# Altium schematic sheet Buffers.DiagrammaStrutturale.SchDoc
size 420 x 297 mm; Address1: Address1; Address2: Address2; Address3: Address3; Address4: Address4; SheetNumber: 1; Scale: 1:1; Разраб.: Иванов; Обозначение документа: АБВГ.123456.001 Э3; Пров.: Петров; Утв.: Сидоров; Наименование организации: ОАО "Концерн "МПО-Гидроприбор"; Перв. применение: АБВГ.123456.000; Наименование изделия 1: Плата; Наименование изделия 2: Схема электрическая; Наименование изделия 3: принципиальная; Нач. отд.: Нач. отд.; Фамилия нач. отд.: Сидоров
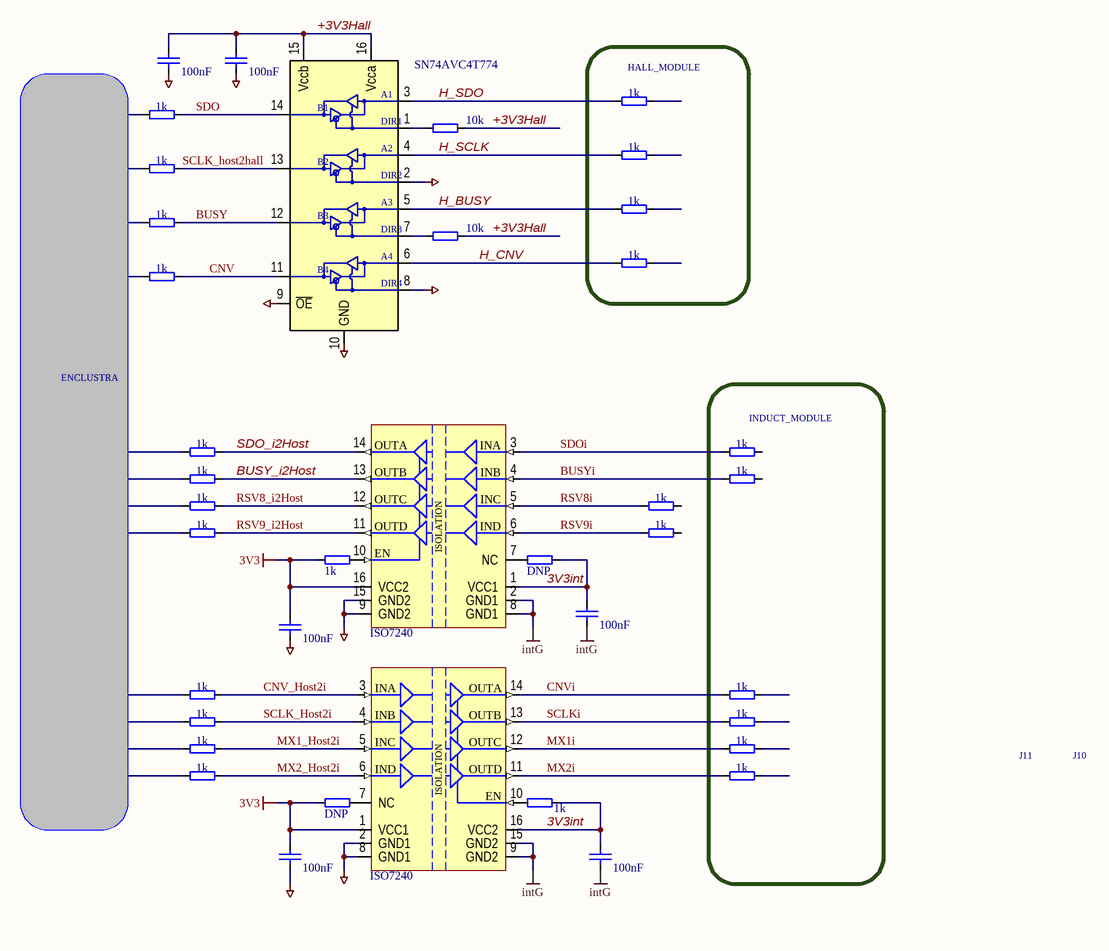
[diagram p0: Buffers.DiagrammaStrutturale.SchDoc]

## Parts
(Parts that share a designator on the sheet are numbered #1, #2 ... from top to bottom, then left to right.)
C?#1  100nF  [SMD0805CAP]
C?#2  100nF  [SMD0805CAP]
C?#3  100nF  [SMD0805CAP]
C?#4  100nF  [SMD0805CAP]
C?#5  100nF  [SMD0805CAP]
C?#6  100nF  [SMD0805CAP]
R?#1  1k  [SMD0805RES]
R?#2  1k  [SMD0805RES]
R?#3  10k  [SMD0805RES]
R?#4  1k  [SMD0805RES]
R?#5  1k  [SMD0805RES]
R?#6  1k  [SMD0805RES]
R?#7  1k  [SMD0805RES]
R?#8  10k  [SMD0805RES]
R?#9  1k  [SMD0805RES]
R?#10  1k  [SMD0805RES]
R?#11  1k  [SMD0805RES]
R?#12  1k  [SMD0805RES]
R?#13  1k  [SMD0805RES]
R?#14  1k  [SMD0805RES]
R?#15  1k  [SMD0805RES]
R?#16  1k  [SMD0805RES]
R?#17  1k  [SMD0805RES]
R?#18  1k  [SMD0805RES]
R?#19  1k  [SMD0805RES]
R?#20  DNP  [SMD0805RES]
R?#21  1k  [SMD0805RES]
R?#22  1k  [SMD0805RES]
R?#23  1k  [SMD0805RES]
R?#24  1k  [SMD0805RES]
R?#25  1k  [SMD0805RES]
R?#26  1k  [SMD0805RES]
R?#27  1k  [SMD0805RES]
R?#28  1k  [SMD0805RES]
R?#29  DNP  [SMD0805RES]
R?#30  1k  [SMD0805RES]
U?#1  SN74AVC4T774  [TSSOP-16]
U?#2  ISO7240  [SOIC127P1030X265-16N]
U?#3  ISO7240  [SOIC127P1030X265-16N]

## Blocks framed on the sheet
HALL_MODULE: R?#1 R?#4 R?#6 R?#9
INDUCT_MODULE: R?#12 R?#14 R?#22 R?#24 R?#26 R?#28

## Nets
3V3: C?#4.2 C?#5.2 R?#19.1 R?#29.1 U?#2.16(VCC2) U?#3.1(VCC1)
GND: C?#1.1 C?#2.1 C?#4.1 C?#5.1 U?#1.2(DIR2) U?#1.8(DIR4) U?#1.9(~{OE}) U?#1.10(GND) U?#2.9(GND2) U?#2.15(GND2) U?#3.2(GND1) U?#3.8(GND1)
intG: C?#3.1 C?#6.1 U?#2.2(GND1) U?#2.8(GND1) U?#3.9(GND2) U?#3.15(GND2)
3V3int: C?#3.2 C?#6.2 R?#20.2 R?#30.2 U?#2.1(VCC1) U?#3.16(VCC2)
+3V3Hall: C?#1.2 C?#2.2 R?#3.1 R?#8.1 U?#1.15(Vccb) U?#1.16(Vcca)
BUSY: R?#7.1 U?#1.12(B3)
BUSY_i2Host: R?#13.1 U?#2.13(OUTB)
BUSYi: R?#14.2 U?#2.4(INB)
CNV: R?#10.1 U?#1.11(B4)
CNV_Host2i: R?#21.1 U?#3.3(INA)
CNVi: R?#22.2 U?#3.14(OUTA)
H_BUSY: R?#6.2 U?#1.5(A3)
H_CNV: R?#9.2 U?#1.6(A4)
H_SCLK: R?#4.2 U?#1.4(A2)
H_SDO: R?#1.2 U?#1.3(A1)
MX1_Host2i: R?#25.1 U?#3.5(INC)
MX1i: R?#26.2 U?#3.12(OUTC)
MX2_Host2i: R?#27.1 U?#3.6(IND)
MX2i: R?#28.2 U?#3.11(OUTD)
RSV8_i2Host: R?#15.1 U?#2.12(OUTC)
RSV8i: R?#16.2 U?#2.5(INC)
RSV9_i2Host: R?#17.1 U?#2.11(OUTD)
RSV9i: R?#18.2 U?#2.6(IND)
SCLK_host2hall: R?#5.1 U?#1.13(B2)
SCLK_Host2i: R?#23.1 U?#3.4(INB)
SCLKi: R?#24.2 U?#3.13(OUTB)
SDO: R?#2.1 U?#1.14(B1)
SDO_i2Host: R?#11.1 U?#2.14(OUTA)
SDOi: R?#12.2 U?#2.3(INA)
NetR?#3_2: R?#3.2 U?#1.1(DIR1)
NetR?#8_2: R?#8.2 U?#1.7(DIR3)
NetR?#19_2: R?#19.2 U?#2.10(EN)
NetR?#20_1: R?#20.1 U?#2.7(NC)
NetR?#29_2: R?#29.2 U?#3.7(NC)
NetR?#30_1: R?#30.1 U?#3.10(EN)

Not connected (* = marked no-connect by the designer): R?#1 1; R?#2 2; R?#4 1; R?#5 2; R?#6 1; R?#7 2; R?#9 1; R?#10 2; R?#11 2; R?#12 1; R?#13 2; R?#14 1; R?#15 2; R?#16 1; R?#17 2; R?#18 1; R?#21 2; R?#22 1; R?#23 2; R?#24 1; R?#25 2; R?#26 1; R?#27 2; R?#28 1

## Notes on the sheet
- ENCLUSTRA
- J11
- J10
- Подп. и дата
- Инв. № дубл.
- Взам. инв. №
- Инв. № подл.
- Изм.
- Лист
- № докум.
- Подп.
- Дата
- Копировал
- Формат А3
- (in symbol ISO7240M) ISOLATION

## Library data of the parts
C?#1-C?#6 = C0805: Чип конденсатор 0805; Voltage: 25V; Vendor: Vishay; DielectricType: X5R; SMD Solders: 2; Solder Option: RM; Tolerance: 20%; Pkg: SMD0805; Device: Cap0805; Value: 100nF; Price: 2
R?#1-R?#18 R?#20-R?#29 = R0805: Чип резистор 0805; Vendor: Vishay; SMD Solders: 2; Solder Option: i; TC: 100ppm/C; Tolerance: 1%; Pkg: SMD0805; Pwr: 125mW; Device: Res0805; Price: 2
  R?#1 R?#2 R?#4-R?#7 R?#9-R?#18 R?#21-R?#28: Value: 1k
  R?#3 R?#8: Value: 10k
  R?#20 R?#29: Value: DNP
R?#19 R?#30 = R0805: Чип резистор 0805; Vendor: Vishay; SMD Solders: 2; Solder Option: RM; TC: 100ppm/C; Tolerance: 1%; Pkg: SMD0805; Pwr: 125mW; Device: Res0805; Price: 2; Value: 1k
U?#1 = SN74AVC4T774: Двунаправленный буфер; Pkg: TSSOP16; SMD Solders: 16; Solder Option: RM; THD Solders: 0; Vendor: Texas Instruments; Voltage: 1V1.. 3.6V  I/Os are 4.6-V Tolerant; Name to order: SN74AVC4T774PW; Device: SN74AVC4T774; Price: 300
U?#2 U?#3 = ISO7240M: Двунаправленный буфер; Pkg: SOIC16DW; SMD Solders: 16; Solder Option: RM; THD Solders: 0; Vendor: Texas Instruments; Voltage: 3V3 or 5V; Name to order: ISO7240MDWR; Current: 30; Device: ISO7240; Price: 3500